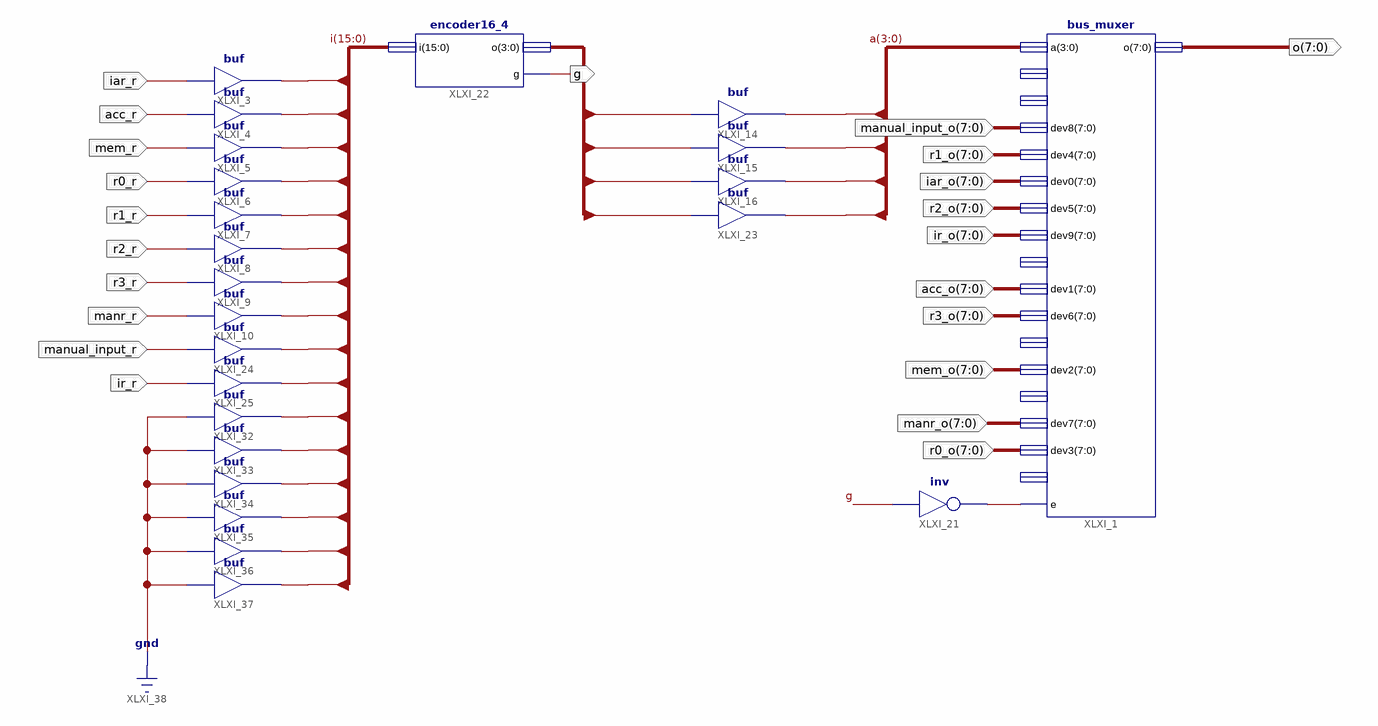
[diagram p0: schematic sheet 1]
// Xilinx ISE schematic cpu_output_muxer.sch (aspartan6) as structural Verilog: 23 symbols, 22 ports
module cpu_output_muxer (
  input  acc_r,
  input  mem_r,
  input  r0_r,
  input  r2_r,
  input  r3_r,
  input  iar_r,
  input  r1_r,
  input  [7:0] iar_o,
  input  [7:0] acc_o,
  input  [7:0] mem_o,
  input  [7:0] r0_o,
  input  [7:0] r1_o,
  input  [7:0] r2_o,
  input  [7:0] r3_o,
  input  manr_r,
  input  [7:0] manr_o,
  input  manual_input_r,
  input  [7:0] manual_input_o,
  input  ir_r,
  input  [7:0] ir_o,
  output [7:0] o,
  output g
);

  wire XLXN_73;
  wire [3:0] a, enc_o;
  wire [15:0] i;

  buf XLXI_3 (i[0], iar_r);
  buf XLXI_4 (i[1], acc_r);
  buf XLXI_5 (i[2], mem_r);
  buf XLXI_6 (i[3], r0_r);
  buf XLXI_7 (i[4], r1_r);
  buf XLXI_8 (i[5], r2_r);
  buf XLXI_9 (i[6], r3_r);
  buf XLXI_10 (i[7], manr_r);
  bus_muxer XLXI_1 (
    .a(a), .dev0(iar_o), .dev1(acc_o), .dev2(mem_o), .dev3(r0_o), .dev4(r1_o), .dev5(r2_o), .dev6(r3_o),
    .dev7(manr_o), .dev8(manual_input_o), .dev9(ir_o), .e(XLXN_73), .o(o));  // open: dev10, dev11, dev12, dev13, dev14, dev15
  buf XLXI_14 (a[0], enc_o[0]);
  buf XLXI_15 (a[1], enc_o[1]);
  buf XLXI_16 (a[2], enc_o[2]);
  not XLXI_21 (XLXN_73, g);
  encoder16_4 XLXI_22 (.g(g), .i(i), .o(enc_o));
  buf XLXI_23 (a[3], enc_o[3]);
  buf XLXI_24 (i[8], manual_input_r);
  buf XLXI_25 (i[9], ir_r);
  buf XLXI_32 (i[10], 1'b0);
  buf XLXI_33 (i[11], 1'b0);
  buf XLXI_34 (i[12], 1'b0);
  buf XLXI_35 (i[13], 1'b0);
  buf XLXI_36 (i[14], 1'b0);
  buf XLXI_37 (i[15], 1'b0);
endmodule
